# EAGLE board TLog (EAGLE 8.5.1)
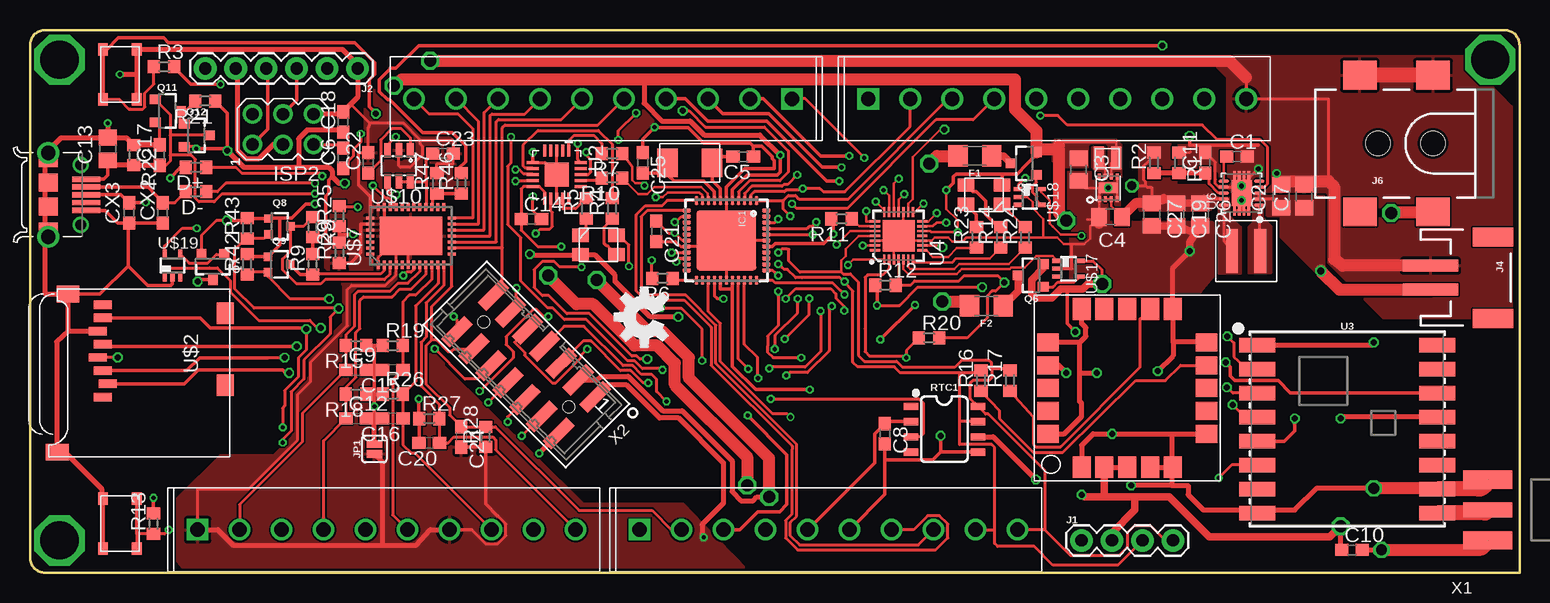
[diagram p7: board, top side]
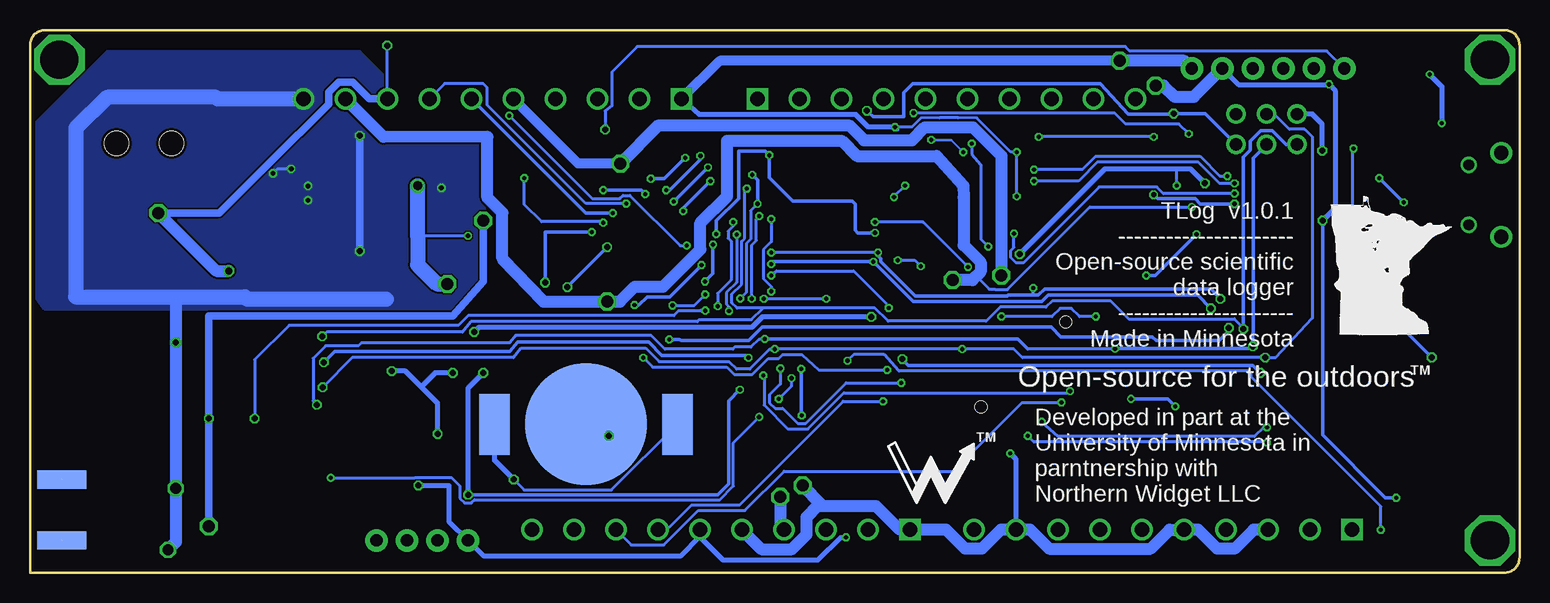
[diagram p8: board, bottom side, seen from below]

Size 124.13 x 45.27 mm. Coordinates in mm from the lower left corner, seen from the top.
Outline: 0,44 0,1.27 arc90 1.27,0 124.13,0 124.13,44 arc90 122.86,45.27 1.27,45.27 arc90 0,44
Copper layers (1*16): Top 0.035559375mm / dielectric 1.6mm / Bottom 0.035559375mm
Design rules "BayAreaCircuit *": minimum track width 5mil, minimum drill 10mil, track to track 5mil, track to pad 6mil, pad to pad 6mil, via to via 6mil, smd to smd 5mil, copper to edge 10mil, drill to drill 6mil, minimum pad ring 6mil, minimum via ring 6mil, stop-mask expansion 2.5mil, vias tented up to drill 0mil, thermal gap 10mil
tKeepout: area 0.1,40.5 to 4.8,45.1; area 0.1,0.4 to 4.8,5; area 119.4,40.5 to 124,45.1

## Footprints (pad centres in the part's own frame; a part is rotated, then mirrored left to right if it is on the bottom)
AWICKERT_LINX_BAT-HLD-012-SMT = smd 10.16 x 10.16: GND 0,0 | smd 2.54 x 5.08: POWER0 -7.62,0; POWER1 7.62,0
C0603 = smd 1.1 x 1: 1 -0.85,0; 2 0.85,0
C0805 = smd 1.3 x 1.5: 1 -0.95,0; 2 0.95,0
R0603 = smd 1 x 1.1: 1 -0.85,0; 2 0.85,0
1206 = smd 1.6 x 1.8: 1 -1.4,0; 2 1.4,0
MLF44-TH = smd 0.7 x 0.3: 1 -3.325,2.5; 2 -3.325,2; 3 -3.325,1.5; 4 -3.325,1; 5 -3.325,0.5; 6 -3.325,0; 7 -3.325,-0.5; 8 -3.325,-1; 9 -3.325,-1.5; 10 -3.325,-2; 11 -3.325,-2.5; 23 3.325,-2.5; 24 3.325,-2; 25 3.325,-1.5; 26 3.325,-1; 27 3.325,-0.5; 28 3.325,0; 29 3.325,0.5; 30 3.325,1; 31 3.325,1.5; 32 3.325,2; 33 3.325,2.5 | smd 0.3 x 0.7: 12 -2.5,-3.325; 13 -2,-3.325; 14 -1.5,-3.325; 15 -1,-3.325; 16 -0.5,-3.325; 17 0,-3.325; 18 0.5,-3.325; 19 1,-3.325; 20 1.5,-3.325; 21 2,-3.325; 22 2.5,-3.325; 34 2.5,3.325; 35 2,3.325; 36 1.5,3.325; 37 1,3.325; 38 0.5,3.325; 39 0,3.325; 40 -0.5,3.325; 41 -1,3.325; 42 -1.5,3.325; 43 -2,3.325; 44 -2.5,3.325 | smd 5 x 5: TH 0,0
AVRISP = drill 1.02 pad 1.626: 1 -1.27,2.54; 2 1.27,2.54; 3 -1.27,0; 4 1.27,0; 5 -1.27,-2.54; 6 1.27,-2.54
1X04 = drill 1.016 pad 1.88: 1 0,0; 2 2.54,0; 3 5.08,0; 4 7.62,0
1X06 = drill 1.016 pad 1.88: 1 0,0; 2 2.54,0; 3 5.08,0; 4 7.62,0; 5 10.16,0; 6 12.7,0
JST-2-SMD = smd 1 x 4.6: 1 -1,-3.7; 2 1,-3.7 | smd 1.6 x 3.4: NC1 -3.4,1.5; NC2 3.4,1.5
1X10_3.5MM_SCREW = drill 1.2 square: P$1 0,0 | drill 1.2: P$2 3.5,0; P$3 7,0; P$4 10.5,0; P$5 14,0; P$6 17.5,0; P$7 21,0; P$8 24.5,0; P$9 28,0; P$10 31.5,0
POWER_JACK_SMD = smd 2.8 x 2.4: GND 0,-5.7; P$4 6.1,-5.7; VIN0 0,5.7; VIN1 6.1,5.7 | hole 2.032: 0,0; 4.572,0
SMT-JUMPER_2_NC_PASTE_SILK = smd 0.635 x 1.27: 1 -0.406,0; 2 0.406,0
0806 = smd 0.85 x 1.9: P$1 -0.725,0; P$2 0.725,0
10118194-0001LF_10118194-0001LF_LONGER_PADS = smd 0.45 x 2.35: 1 -1.3,3.175; 2 -0.65,3.175; 3 0,3.175; 4 0.65,3.175; 5 1.3,3.175 | drill 0.9: P$6 -2.5,2.7; P$7 2.5,2.7 | drill 1.2: P$8 -3.5,0; P$9 3.5,0 | smd 1.5 x 1.55: P$10 -1,0; P$11 1,0; P$12 -3.05,0; P$13 3.05,0
SOT23-3 = smd 0.8 x 0.9: 1 -0.95,-1; 2 0.95,-1; 3 0,1.1
SOT323 = smd 0.7 x 0.7: 1 -0.65,-0.925; 2 0.65,-0.925; 3 0,0.925
SO08 = smd 0.6 x 1.2: 1 -1.905,-2.8; 2 -0.635,-2.8; 3 0.635,-2.8; 4 1.905,-2.8; 5 1.905,2.8; 6 0.635,2.8; 7 -0.635,2.8; 8 -1.905,2.8
QFN20 = smd 1 x 0.25: 1 -2.032,0.968; 2 -2.032,0.468; 3 -2.032,-0.032; 4 -2.032,-0.532; 5 -2.032,-1.032; 11 1.968,-1.032; 12 1.968,-0.532; 13 1.968,-0.032; 14 1.968,0.468; 15 1.968,0.968 | smd 0.25 x 1: 6 -1.032,-2.032; 7 -0.532,-2.032; 8 -0.032,-2.032; 9 0.468,-2.032; 10 0.968,-2.032; 16 0.968,1.968; 17 0.468,1.968; 18 -0.032,1.968; 19 -0.532,1.968; 20 -1.032,1.968 | smd 2 x 2: 21 -0.032,-0.032
RFM69HCW-XXXS2 = smd 3 x 1.2: 1 -7.5,7; 2 -7.5,5; 3 -7.5,3; 4 -7.5,1; 5 -7.5,-1; 6 -7.5,-3; 7 -7.5,-5; 8 -7.5,-7; 9 7.5,-7; 10 7.5,-5; 11 7.5,-3; 12 7.5,-1; 13 7.5,1; 14 7.5,3; 15 7.5,5; 16 7.5,7
QFN-28 = smd 0.85 x 0.2: 1 -1.975,1.2; 2 -1.975,0.8; 3 -1.975,0.4; 4 -1.975,0; 5 -1.975,-0.4; 6 -1.975,-0.8; 7 -1.975,-1.2; 15 1.975,-1.2; 16 1.975,-0.8; 17 1.975,-0.4; 18 1.975,0; 19 1.975,0.4; 20 1.975,0.8; 21 1.975,1.2 | smd 0.2 x 0.85: 8 -1.2,-1.975; 9 -0.8,-1.975; 10 -0.4,-1.975; 11 0,-1.975; 12 0.4,-1.975; 13 0.8,-1.975; 14 1.2,-1.975; 22 1.2,1.975; 23 0.8,1.975; 24 0.4,1.975; 25 0,1.975; 26 -0.4,1.975; 27 -0.8,1.975; 28 -1.2,1.975 | smd 2.65 x 2.65: 29 0,0
PWSON-N10 = smd 0.28 x 0.85: 1 -1,-1.475; 2 -0.5,-1.475; 3 0,-1.475; 4 0.5,-1.475; 5 1,-1.475; 6 1,1.475; 7 0.5,1.475; 8 0,1.475; 9 -0.5,1.475; 10 -1,1.475 | smd 2.15 x 1.66: THERMAL@1 0,0 | drill 0.4 pad 0.6: THERMAL@5 -0.6,0; THERMAL@6 0.6,0 | smd 0.8 x 0.23: THERMAL@7 1.46,0.6; THERMAL@8 1.46,0.2; THERMAL@9 1.46,-0.2; THERMAL@10 1.46,-0.6; THERMAL@11 -1.46,-0.6; THERMAL@12 -1.46,-0.2; THERMAL@13 -1.46,0.2; THERMAL@14 -1.46,0.6
CRYSTAL_5X3.2_2-SMD = smd 1.7 x 2.4: OSC1 -1.85,0; OSC2 1.85,0
MICROSD = smd 0.7 x 1.5: 1 9,-10.64; 2 7.9,-10.24; 3 6.8,-10.64; 4 5.7,-11.04; 5 4.6,-10.64; 6 3.5,-11.04; 7 2.4,-10.64; 8 1.3,-10.64 | smd 1.8 x 1.4: CD1 2,-0.44; CD2 8,-0.44 | smd 1.4 x 1.9: MT1 0.4,-13.54; MT2 13.6,-14.44
WSON-8-PAD = smd 0.25 x 0.5: 1 -0.75,-0.95; 2 -0.25,-0.95; 3 0.25,-0.95; 4 0.75,-0.95; 5 0.75,0.95; 6 0.25,0.95; 7 -0.25,0.95; 8 -0.75,0.95 | smd 1.6 x 0.9: PAD 0,0
SWITCH_4.2X3.2 = smd 1.05 x 0.812: 1 -2.075,1.4; 2 2.075,1.4; 3 -2.075,-1.4; 4 2.075,-1.4
SAM-M8Q = smd 1.5 x 1.8: 1 -3.8,-6.6; 2 -1.9,-6.6; 3 0,-6.6; 4 1.9,-6.6; 5 3.8,-6.6; 11 3.8,6.6; 12 1.9,6.6; 13 0,6.6; 14 -1.9,6.6; 15 -3.8,6.6 | smd 1.8 x 1.5: 6 6.6,-3.8; 7 6.6,-1.9; 8 6.6,0; 9 6.6,1.9; 10 6.6,3.8; 16 -6.6,3.8; 17 -6.6,1.9; 18 -6.6,0; 19 -6.6,-1.9; 20 -6.6,-3.8
QFN38-5X7 = smd 0.7 x 0.25: 1 -2.4,2.75; 2 -2.4,2.25; 3 -2.4,1.75; 4 -2.4,1.25; 5 -2.4,0.75; 6 -2.4,0.25; 7 -2.4,-0.25; 8 -2.4,-0.75; 9 -2.4,-1.25; 10 -2.4,-1.75; 11 -2.4,-2.25; 12 -2.4,-2.75; 20 2.4,-2.75; 21 2.4,-2.25; 22 2.4,-1.75; 23 2.4,-1.25; 24 2.4,-0.75; 25 2.4,-0.25; 26 2.4,0.25; 27 2.4,0.75; 28 2.4,1.25; 29 2.4,1.75; 30 2.4,2.25; 31 2.4,2.75 | smd 0.25 x 0.7: 13 -1.5,-3.4; 14 -1,-3.4; 15 -0.5,-3.4; 16 0,-3.4; 17 0.5,-3.4; 18 1,-3.4; 19 1.5,-3.4; 32 1.5,3.4; 33 1,3.4; 34 0.5,3.4; 35 0,3.4; 36 -0.5,3.4; 37 -1,3.4; 38 -1.5,3.4 | smd 3.2 x 5.2: EXP 0,0
WE-MAIA(4.1X4.1) = smd 0.98 x 3.7: P$1 -1.185,0; P$2 1.185,0
SOT23-6L = smd 0.55 x 1.2: 1 -0.95,-1.3; 2 0,-1.3; 3 0.95,-1.3; 4 0.95,1.3; 5 0,1.3; 6 -0.95,1.3
CLVBA-FKA = smd 1.4 x 1.1: 1 -1.5,0.8; 2 -1.5,-0.8; 3 1.5,-0.8; 4 1.5,0.8
DCK_R-PDSO-G5 = smd 0.35 x 0.8: 1 -0.65,-0.95; 2 0,-0.95; 3 0.65,-0.95; 4 0.65,0.95; 5 -0.65,0.95
ADAFRUIT_SMA_EDGELAUNCH = smd 4.064 x 1.524: GND@1 2.032,-2.54; GND@2 2.032,2.54 | smd 4.064 x 1.524 bottom: GND@3 2.032,2.54; GND@4 2.032,-2.54 | smd 4.064 x 1.27: P 2.032,0
87832-14 = smd 1 x 2.75: 1 -6,-2.15; 2 -6,2.15; 3 -4,-2.15; 4 -4,2.15; 5 -2,-2.15; 6 -2,2.15; 7 0,-2.15; 8 0,2.15; 9 2,-2.15; 10 2,2.15; 11 4,-2.15; 12 4,2.15; 13 6,-2.15; 14 6,2.15 | hole 1: -5,0; 5,0

## Placement (x,y rotation side)
BT1  BATTERY_COIN12MM  [AWICKERT_LINX_BAT-HLD-012-SMT]  77.79,12.38 0 bottom
C1  0.1uF  [C0603]  100.58,34.7 0 top
C2  10uF  [C0805]  104.27,31.4 90 top
C3  22uF  [C0805]  87.38,33.62 270 top
C4  2.2uF  [C0805]  90.04,29.69 180 top
C5  12pF  [C0603]  59.44,34.7 180 top
C6  0.1uF  [C0603]  26.1,34.58 90 top
C7  10uF  [C0805]  106.17,31.4 90 top
C8  0.1uF  [C0603]  71.25,11.59 270 top
C9  0.1uF  [C0603]  27.18,16.92 0 top
C10  0.1uF  [C0603]  110.17,1.9 0 top
C11  10pF  [C0603]  97.92,34.19 90 top
C12  0.1uF  [C0603]  27.18,12.86 0 top
C13  10uF  [C0805]  6.48,35.34 90 top
C14  0.1uF  [C0603]  41.78,29.5 0 top
C15  0.1uF  [C0603]  30.23,16.92 180 top
C16  0.1uF  [C0603]  30.23,12.86 180 top
C17  0.1uF  [C0603]  10.79,34.83 90 top
C18  0.1uF  [C0603]  26.1,37.59 90 top
C19  22uF  [C0805]  95.5,29.88 270 top
C20  0.1uF  [C0603]  33.27,10.83 180 top
C21  1uF  [C0603]  52.2,28.48 270 top
C22  0.1uF  [C0603]  28.19,34.19 90 top
C23  0.1uF  [C0603]  34.42,34.96 0 top
C24  0.1uF  [C0603]  35.94,11.33 270 top
C25  12pF  [C0603]  51.05,34.19 270 top
C26  22uF  [C0805]  97.54,29.88 270 top
C27  22uF  [C0805]  93.47,29.88 270 top
CX2  12pF  [C0603]  11.05,30 90 top
CX3  12pF  [C0603]  8.25,30 90 top
D+  27ohm  [R0603]  13.84,33.81 180 top
D-  27ohm  [R0603]  13.84,31.78 180 top
F1  PPTC_HALF-AMP  [1206]  78.74,34.77 180 top
F2  PPTC_HALF-AMP  [1206]  79.69,22.26 180 top
IC1  ATMEGA644M  [MLF44-TH]  58.04,27.72 270 top
ISP2  AVRISP-6  [AVRISP]  21.08,36.99 90 top
J1  [1X04]  87.63,2.7 0 top
J2  [1X06]  27.3,42.07 180 top
J4  [JST-2-SMD]  120.41,24.61 270 top
J5  [1X10_3.5MM_SCREW]  63.5,39.53 180 top
J6  5.5x2.1mm Barrel  [POWER_JACK_SMD]  116.92,35.8 180 top
J8  [1X10_3.5MM_SCREW]  13.97,3.59 0 top
J9  [1X10_3.5MM_SCREW]  50.8,3.59 0 top
J10  [1X10_3.5MM_SCREW]  69.85,39.53 0 top
JP1  JUMPER-SMT_2_NC_PASTE_SILK  [SMT-JUMPER_2_NC_PASTE_SILK]  28.7,10.32 90 top
L2  2.2uF  [0806]  89.79,34.58 0 top
LOGO1  OSHW-LOGOM  [OSHW-LOGO-M]  51.18,21.33 90 top
MICRO_USB  MICRO_USB_LONGPADS  [10118194-0001LF_10118194-0001LF_LONGER_PADS]  1.52,31.53 270 top
Q5  MOSFET_PCH-IRLML2244  [SOT23-3]  82.87,34.13 90 top
Q6  MOSFET_PCH-IRLML2244  [SOT23-3]  83.44,24.8 90 top
Q7  MOSFET_PCH-IRLML2244  [SOT23-3]  15.24,25.56 180 top
Q8  310mA/60V/1.6Ω  [SOT323]  20.8,28.89 270 top
Q9  310mA/60V/1.6Ω  [SOT323]  20.76,25.72 270 top
Q11  MOSFET-NCH-BSS138  [SOT23-3]  11.43,38.51 270 top
Q12  MOSFET_PCH-IRLML2244  [SOT23-3]  13.84,36.48 270 top
R1  111k  [R0603]  95.76,34.19 270 top
R2  1M  [R0603]  93.66,34.19 90 top
R3  10k  [R0603]  11.18,42.2 0 top
R4  330  [R0603]  48.51,30.38 90 top
R5  330  [R0603]  46.35,30.38 90 top
R6  330  [R0603]  52.7,24.54 180 top
R7  330  [R0603]  48.51,34.96 180 top
R8  10k  [R0603]  23.56,28.83 270 top
R9  10k  [R0603]  23.56,25.72 90 top
R10  330  [R0603]  48.51,32.92 180 top
R11  10k  [R0603]  67.63,29.53 180 top
R12  10k  [R0603]  71.28,23.97 0 top
R13  10k  [R0603]  10.29,4.1 90 top
R14  330  [R0603]  80.9,27.97 90 top
R15  10k  [R0603]  27.18,18.95 180 top
R16  FB  [R0603]  79.25,16.03 90 top
R17  FB  [R0603]  81.66,16.03 90 top
R18  10k  [R0603]  27.18,14.89 180 top
R19  10k  [R0603]  30.23,18.95 0 top
R20  180k  [R0603]  74.93,19.59 0 top
R21  10k  [R0603]  14.6,39.34 180 top
R22  10k  [R0603]  8.64,34.83 270 top
R23  330  [R0603]  78.87,27.97 90 top
R24  330  [R0603]  82.93,27.97 90 top
R25  10k  [R0603]  25.78,29.75 90 top
R26  10k  [R0603]  30.23,14.89 0 top
R27  10k  [R0603]  33.27,12.86 0 top
R28  10k  [R0603]  37.97,11.33 90 top
R29  10k  [R0603]  25.78,26.7 90 top
R42  10k  [R0603]  18.1,25.72 90 top
R43  10k  [R0603]  18.1,28.73 90 top
R46  10k  [R0603]  35.94,32.48 90 top
R47  10k  [R0603]  33.91,32.48 90 top
RTC1  DS3231M  [SO08]  76.2,11.97 270 top
U2  FT231X-Q  [QFN20]  43.94,33.18 270 top
U3  915MHz  [RFM69HCW-XXXS2]  109.78,11.99 0 top
U4  SX1509  [QFN-28]  72.39,28.1 90 top
U6  [PWSON-N10]  100.97,31.65 90 top
U$1  CRYSTAL_5X3.2_2LEAD8MHZ  [CRYSTAL_5X3.2_2-SMD]  54.99,34.19 0 top
U$2  MICROSD  [MICROSD]  16.7,23.65 270 top
U$3  NWLOGO_MED  [NWLOGO_MED]  49.07,8.76 0 bottom
U$4  TPS62172-Q1  [WSON-8-PAD]  89.85,32.1 0 top
U$5  BUTTON4.2X3.2  [SWITCH_4.2X3.2]  7.49,4.1 90 top
U$6  SAM-M8Q  [SAM-M8Q]  91.44,15.4 0 top
U$7  LTC2495  [QFN38-5X7]  31.75,28.1 90 top
U$8  1uH  [WE-MAIA(4.1X4.1)]  101.35,26.83 180 top
U$9  BUTTON4.2X3.2  [SWITCH_4.2X3.2]  7.49,41.56 270 top
U$10  MAX6070AAUT18  [SOT23-6L]  30.73,33.94 180 top
U$13  [MN_SILK]  7.38,19.81 0 top
U$15  CLVBA-FKA  [CLVBA-FKA]  79.5,31.53 180 top
U$16  CLVBA-FKA  [CLVBA-FKA]  47.37,27.34 0 top
U$17  MIC842H  [DCK_R-PDSO-G5]  86.55,25.37 270 top
U$18  MIC842H  [DCK_R-PDSO-G5]  83.31,31.34 270 top
U$19  MIC842H  [DCK_R-PDSO-G5]  11.87,25.62 0 top
X1  [ADAFRUIT_SMA_EDGELAUNCH]  123.51,5.24 180 top
X2  87832-14  [87832-14]  41.35,17.38 135 top

## Tracks (layer width: path | path; a pad name or v marks a point on that pad's centre or on a via)
3.3V_EXT_CTRL  (via drill 0.35)
  Top 0.203: U4.13 75.24,28.9 75.56,29.21 75.87,29.21 v76.36,29.19
  Top 0.254: v82.93,32.92 82.36,32.36 U$18.1
  Bottom 0.254: v76.36,29.19 76.36,29.27 81.5,29.27 82.93,30.7 v82.93,32.92
3V3  (via drill 0.35, 0.4, 0.5, 0.5 pad 0.2, 1)
  Top 0.2: v77.31,28.42 77.31,29.4 76.36,30.35 v76.36,31.91 | U$4.6 90.1,34.16 L2.P$2 90.51,35.9 86.11,35.9 85.74,35.64
  Top 0.203: U4.18 72.39,31.11 v72.87,31.59 | U4.4 72.39,23.97 | 77.17,28.43 v77.31,28.42 | 77.31,28.5 v77.31,28.42 | U4.12 75.01,28.5 75.09,28.42 v77.31,28.42
  Top 0.254: v16.42,29.37 15.53,29.37 14.29,28.13 Q7.2 | 72.39,23.97 73.34,23.97 73.71,24.34 77.42,24.34 77.85,24.78 80.65,24.78 v81.2,24.21 80.48,23.49 80.16,23.49 79.75,23.08 79.75,21.24 78.1,19.59 R20.2 | C21.1 53.17,28.35 v53.72,28.35 54.36,27.72 IC1.17 | v30.49,31.53 30.16,31.53 29.78,31.91 U$10.4
  Top 0.305: 19.77,26.57 Q9.1 | R43.2 18.1,29.84 | v16.42,29.37 18.1,29.37 R43.2 | Q7.2 14.13,26.56 | 72.39,23.97 R12.2 | R11.2 66.94,29.37 v66.94,28.26 | v64.97,15.27 60.48,15.27 58.54,17.21 58.54,23.65 | 58.54,23.65 IC1.29 | IC1.27 57.54,23.65 58.54,23.65 | IC1.5 | 58.56,31.04 IC1.5 | v62.52,34.82 62.52,33.42 62.28,33.18 59.78,33.18 58.54,31.94 IC1.5 | v10.29,6.25 R13.2 | v76.36,31.91 76.95,32.5 76.95,33.02 77.19,33.27 81,33.27 | 81,33.27 82.26,33.27 83.06,34.07 83.87,34.88 Q5.2 | U$15.2 81,33.27 | IC1.38 61.84,27.22 62.09,27.47 66.15,27.47 v66.94,28.26 | 66.93,29.2 v66.94,28.26 | 20.8,29.59 21.83,29.59 23,30.77 v23.75,30.77 | R3.2 12.03,42.11 13.4,40.74 v15.87,40.74 | 20.8,29.59 20.8,27.32 Q9.1 | Q9.1 18.3,26.37 R42.2 | 20.8,29.59 19.92,29.59 Q8.1 18.14,29.54 R43.2
  Top 0.406: C10.1 109.22,2.01 v109.22,3.89 | U3.13 109.22,12.99 v109.22,12.86 | 89.31,6.35 89.54,6.58 | U$6.2 U$6.3 | U$6.17 85.73,17.3 v86.36,16.67 | v62.52,34.82 60.83,36.51 56.19,36.51 55.02,37.68 52.64,37.68 51.18,39.15 51.18,41.14
  Top 0.61: v109.22,3.89 108.33,3.02 98.27,3.02 94.93,6.35 92.08,6.35 | 92.08,6.35 89.31,6.35 87.92,6.35 v87.63,6.51 | J1.2 90.17,3.33 92.08,5.24 92.08,6.35 | 89.54,6.58 U$6.2
  Top 1.016: v30.32,40.64 30.95,41.14 51.18,41.14 82.07,41.14 82.07,38.65 83.87,36.86 Q5.2 84.1,35.32 85.74,35.32 | v86.36,29.37 85.74,30.02 85.74,35.32 | 85.74,35.32 85.74,35.64
  Bottom 0.305: J2.2 | v16.42,29.37 16.42,11.49 11.18,6.25 v10.29,6.25 | v72.87,31.59 73.18,31.91 v76.36,31.91 | v81.2,24.21 81.2,28.42 v77.31,28.42 | v87.63,6.51 66.8,6.51 65.91,7.4 65.91,14.33 v64.97,15.27 | v53.72,28.35 55.16,28.35 55.37,28.57 55.37,30.77 55.63,31.02 60.58,31.02 62.52,32.96 v62.52,34.82 62.86,35.16 65.09,35.16 65.09,31.22 66.94,29.37 v66.94,28.26 | v23.75,30.77 26.61,30.77 27.05,31.2 30.16,31.2 v30.49,31.53
  Bottom 0.406: J2.2 23.43,40.73 15.88,40.73 v15.87,40.74 15.37,40.23 15.37,30.42 v16.42,29.37 | v86.36,16.67 87.63,15.4 v87.63,6.51
  Bottom 0.61: v109.22,3.89 v109.22,12.86 109.22,21.43 88.9,21.43 86.36,24.29 v86.36,29.37
  Bottom 1.016: v30.32,40.64 29.69,40.64 28.73,39.69 27.15,39.69 J2.2
  pour Top (isolate 0.152, rank 2, no thermals): 89.92,33.05 89.92,35.59 89.66,35.85 88.39,35.85 88.14,35.59 88.14,33.81 85.73,33.81 85.22,34.32 85.22,35.97 85.34,36.1 90.55,36.1 90.93,35.72 90.93,33.05
5V  (via drill 0.35, 0.5, 0.75, 1)
  Top 0.2: C4.1 90.1,30.58 U$4.3 U$4.2
  Top 0.203: v87.63,28.1 87.51,28.22 85.88,28.22 85.21,28.89 84.97,29.14 84.97,31.03 84.26,31.74 U$18.5
  Top 0.254: U6.9 97.83,31.15 97.83,31.4 | R2.2 93.66,34.79 93,34.12 92.83,33.96 92.83,32.73 92.96,32.6 92.96,32.29 | C27.1 93.47,32.16 93.09,32.16 92.96,32.29 | v91.82,32.29 92.96,32.29 | 30.26,30.5 U$7.29 | 30.26,30.5 U$7.28 | 30.26,30.5 30.26,30.86 29.85,31.27 29.59,31.27 v28.58,32.29 | U$17.5 88.57,26.02 89.34,25.24 v89.34,24.1 | 45.83,26.54 U$16.2 | 12.84,35.37 Q12.2 13.7,35.53 v13.84,35.39 | U$19.5 11.22,27.26 12.7,28.73 v13.91,28.73
  Top 0.305: 97.83,31.4 C26.1 | R9.2 R8.2 24.26,27.98 24.64,28.35 24.64,31.4 24.89,31.65 24.89,32.73 25.18,33.03 | 45.87,26.49 U$16.2 | v87.12,20.08 86.43,20.77 86.43,23.67 | R21.1 16.45,38.35 v16.45,35.19 16.26,35.39 v13.84,35.39
  Top 0.406: v16.45,35.19 17.83,33.81 22.35,33.81 | C18.1 25.96,36.95 23.14,36.95 22.39,36.2 22.39,33.92 22.35,33.81 | v54.02,21.35 51.7,21.35 48.77,24.29 48.77,24.83 47.1,26.49 45.87,26.49 41.74,26.49 v41.66,26.57 | v26.23,32.48 25.73,32.48 25.18,33.03 25.18,33.52 24.89,33.81 22.35,33.81
  Top 0.61: 94.68,31.11 C27.1 | 94.68,31.11 C19.1 C26.1 | 94.49,31.3 94.68,31.11 | v89.34,24.1 88.16,24.1 87.74,23.67 86.43,23.67 85.88,23.67 85.14,22.93 83.8,22.93 83.47,23.26 83.47,24.43 84.44,25.4 Q6.2
  Top 0.813: C27.1 92.13,30.83 C4.1
  Bottom 0.254: v87.63,28.1 91.82,28.1 91.82,28.09 | v28.58,32.29 28.58,33.69 | v13.91,28.73 13.91,35.32 v13.84,35.39
  Bottom 0.305: 86.9,20.3 v87.12,20.08
  Bottom 0.406: v16.45,35.19 16.45,37.43 17.27,38.26 ISP2.2 | v41.66,26.57 34.54,33.69 28.58,33.69 27.43,33.69 v26.23,32.48 | v54.02,21.35 63.09,21.35 63.97,20.47 86.73,20.47 v87.12,20.08
  Bottom 1.27: v91.82,32.29 91.82,28.09 91.82,25.69 90.23,24.1 v89.34,24.1
  pour Top (isolate 0.152, rank 3, no thermals): 99.95,31.27 98.93,31.27 97.92,32.29 95.5,32.29 95.5,35.72 92.46,35.72 92.46,30.26 98.3,30.26 98.93,31.02 99.95,31.02
5V_EXT_CTRL
  Top 0.2: 81.34,25.32 81.66,25.32 81.78,25.45 82.89,25.45 83.84,26.4 85.22,26.4 U$17.1
  Top 0.203: U4.5 72.79,25.32 73.18,24.92 77.23,24.92 77.47,25.16 77.63,25.32 | 77.63,25.32 | 77.63,25.32 | 77.63,25.32 | 77.63,25.32 81.34,25.32 | 85.37,26.02 U$17.1
5V_PSYNC  (via drill 0.35)
  Top 0.2: U4.27 69.42,27.3 v69.4,27.28
  Top 0.254: v84.2,38.13 85.65,38.13 86.44,37.34 97.7,37.34 98.92,36.11 102.51,36.11 103.14,35.48 103.14,32.44 102.86,32.15 U6.4
  Bottom 0.254: v84.2,38.13 77.28,31.2 74.97,31.2 74.7,31.46 74.14,31.46 69.96,27.28 v69.4,27.28
ADC0
  Top 0.254: U$7.8 32.5,25.17 31.5,24.16 30.68,24.16 30,23.48 27.35,23.48 27.03,23.17 27.03,20.55 26.33,19.84 R15.2 C9.1 22.71,13.3 22.71,10.93 17.47,5.7 J8.P$2
ADC1
  Top 0.254: U$7.9 33.01,24.91 31.75,23.65 30.82,23.65 30.19,23.02 27.8,23.02 27.49,22.7 27.49,20.36 27.16,20.03 27.16,16.31 26.33,15.48 R18.2 C12.1 24.47,11 J8.P$4
ADC2
  Top 0.254: U$7.10 33.5,24.51 32.13,23.15 31.62,23.15 31.08,22.6 R19.2 C15.1 30.23,16.07 30.23,4.83 J8.P$6
ADC3
  Top 0.254: U$7.11 34,24.13 32.13,22.26 32.13,15.95 R26.2 C16.1 31.08,10.67 31.76,9.99 32.07,9.99 J8.P$8
ADC4
  Top 0.203: U$7.12 34.5,25.59 34.53,25.56
  Top 0.254: U$7.12 34.5,23.99 33.02,22.51 33.02,19.65 32.59,19.22 32.59,15.58 34.12,14.04 R27.2 C20.1 34.84,10.83 35.32,11.31 38.59,11.31 38.8,11.1 38.8,10.26 J8.P$10
ADC5
  Top 0.254: J9.P$2 53.45,3.59 51.84,5.2 45.76,5.2 38.77,12.18 R28.2 C24.1 34.96,13.16 34.96,13.77 32.99,15.75 32.99,18.92 33.46,19.4 | X2.12 35.35,18.69 35.1,18.44 34.83,18.44 33.88,19.4 33.46,19.4 | U$7.13 35.15,23.88 33.46,22.19 33.46,19.4
ADC6
  Top 0.254: 39.37,27.1 U$7.14 | J5.P$5 47.32,37.34 39.6,37.34 39.37,37.12 39.37,27.1 | X2.13 39.37,23.88 39.37,27.1
ADC7
  Top 0.254: U$7.15 38.86,27.6 38.86,37.62 39.04,37.8 44.27,37.8 J5.P$6
ADC8
  Top 0.254: U$7.16 38.35,28.1 38.35,38.13 38.48,38.26 41.23,38.26 J5.P$7
ADC9
  Top 0.254: U$7.17 37.85,28.6 37.85,38.37 J5.P$8
ADC10
  Top 0.254: U$7.18 37.39,29.1 37.39,37.64 J5.P$9
ADC11
  Top 0.254: U$7.19 35.17,29.62 36.93,29.62 36.93,37.01 35.69,38.26 33.27,38.26 J5.P$10
ALIVE_LED  (via drill 0.35)
  Top 0.254: R6.2 51.82,24.58 v51.82,26.07 | v49.91,25.56 49.91,27.34 49.11,28.14 U$16.4
  Bottom 0.254: v51.82,26.07 50.42,26.07 v49.91,25.56
BATT  (via drill 0.5, 0.6, 1)
  Top 0.254: C2.1 arc90 103.69,31.15 U6.2 U6.3
  Top 0.305: v94.36,43.97 32.38,43.97 30.48,42.07 30,42.07 30,42.02 29.12,41.14 29.12,40.14 29.82,39.44 30,39.44 32.74,36.7 35.2,36.7 36.3,35.6 36.3,34.31 35.69,33.7 R46.2
  Top 0.61: 104.78,30.13 104.2,30.7
  Top 1.016: v107.57,25.18 109.14,23.61 J4.2 | v113.43,30 113.52,30.1 J6.VIN0
  Bottom 0.254: J10.P$8 94.35,43.96 v94.36,43.97
  Bottom 0.61: v113.43,30 108.34,30 104.22,34.12 104.21,34.12 99.25,39.09 99.25,40.08 98.4,40.92 97.23,40.92 95.84,39.53 J10.P$8
  Bottom 1.016: v113.43,30 108.6,25.18 v107.57,25.18
  pour Top (no thermals): 108.33,23.91 104.27,27.97 104.27,29.75 103.12,29.75 103.12,30.89 101.98,30.89 101.98,31.4 107.82,31.4 107.82,25.43 108.46,24.8 108.46,23.91
COM  (via drill 0.35)
  Top 0.254: v31.12,24.8 31.39,25.07 31.74,25.07 32,25.33 U$7.7
  Top 0.305: 25.78,28.15 R29.2 | 25.78,28.15 R25.1 | v26.92,28.23 25.86,28.23 25.78,28.15
  Bottom 0.305: v31.12,24.8 30.35,24.8 v26.92,28.23
D1_UNIV  (via drill 0.35)
  Top 0.254: IC1.40 65.23,28.22 v65.24,28.2 | v65.88,21.82 65.88,18.45 64.59,17.16 61.7,17.16 v61.59,17.05 | X2.5 44.28,17.52 46.08,19.32 46.75,19.32 49.2,16.87 50.05,16.87 51.09,15.84 v51.52,15.84
  Bottom 0.254: v65.24,28.2 65.24,24.23 66.1,23.37 66.1,22.4 65.88,22.18 v65.88,21.82 | v61.59,17.05 61.59,15.74 62.5,14.83 62.5,14.18 62.05,13.73 61.41,13.73 60.14,12.46 59.49,12.46 56.11,15.84 v51.52,15.84
D2_UNIV  (via drill 0.35)
  Top 0.254: IC1.41 64.75,28.72 64.95,28.91 65.2,28.91 v65.53,29.24 | v66.82,22.24 66.59,22 66.59,18.51 64.78,16.7 63.28,16.7 v63.03,16.45 | X2.14 35.59,21.09 v35.31,21.37 | v43.18,21.37 42.81,21.37 42.21,21.97 41.94,21.97 39.67,19.7 39.67,19.02 40.25,18.44 40.25,17.93 v37.46,15.14
  Bottom 0.254: v65.53,29.24 65.53,28.91 65.95,28.5 65.95,27.91 65.7,27.66 65.7,24.42 66.82,23.29 v66.82,22.24 | v63.03,16.45 62.96,16.38 62.96,14 60.97,12 59.3,12 56.3,15 37.61,15 v37.46,15.14 | v35.31,21.37 36.66,21.37 37.34,22.05 38.28,22.05 38.96,21.37 v43.18,21.37
DTR  (via drill 0.35)
  Top 0.254: v49.02,36.1 49.02,36.86 v50.51,38.35 | v27.56,36.61 27.56,35.91 26.94,35.29 26.94,34.76 26.1,33.92 C6.1 | U2.18 46.51,33.21 46.74,33.43 46.74,34.45 46.35,34.83 v46.35,35.08
  Bottom 0.2: v46.35,35.08 47.37,36.1 v49.02,36.1
  Bottom 0.254: v27.56,36.61 28.39,37.44 32.83,37.44 33.74,38.35 v50.51,38.35
EXT_3.3V  (via drill 0.35, 1)
  Top 0.305: 71.41,12.6 arc90 C8.1 70.38,11.57 70.38,9.17 J9.P$5 | 71.41,12.6 RTC1.2 | 71.41,12.38 71.41,12.6
  Top 0.406: v42.43,9.95 42.43,9.98 X2.2
  Top 1.016: v74.93,34.13 75.56,34.77 F1.2 | v43.18,24.8 43.65,24.29 45.54,22.41 46.93,22.41 50.39,18.95 52.25,18.95 53.75,17.46 53.75,15.68 59.75,9.67 v59.75,7.27
  Bottom 0.406: J8.P$9 41.97,9.49 v42.43,9.95
  Bottom 0.813: 74.95,34.13 78.45,34.13 J10.P$5
  Bottom 1.016: v74.93,34.13 74.95,34.13 71.83,37.27 55.82,37.27 54.63,36.08 50.62,36.08 49.56,37.15 45.55,37.15 43.18,34.77 v43.18,24.8 | J9.P$5 63.19,1.98 60.63,1.98 59.41,3.2 59.41,4.64 58.47,5.58 58.25,5.58 58.15,5.67 | 58.15,5.67 v59.75,7.27 | 58.15,5.67 58.06,5.58 53.63,5.58 51.64,3.59 J9.P$1 47.79,3.59 46.2,2 44.8,2 43.22,3.59 J8.P$9 40.79,3.59 39.2,2 30.74,2 29.15,3.59 J8.P$5 26.79,3.59 25.2,2 23.74,2 22.15,3.59 J8.P$3
EXT_5V  (via drill 0.35, 1)
  Top 0.254: v27.3,30.51 25.87,30.51 R25.2
  Top 0.406: X2.3 47.24,16.07 47.56,16.39 49.85,16.39 52.73,13.51 54.34,13.51 58.5,9.35 58.5,6.75 59.23,6.02 60.27,6.02 60.57,6.32 v61.59,6.32
  Top 1.016: v76.04,22.62 78.29,22.62 F2.2 | v61.59,6.32 61.59,9.56 54.91,16.24 54.91,17.94 52.73,20.12 51.54,20.12 v47.24,24.42
  Bottom 0.254: 44.92,25.1 44.98,24.44 44.2,23.65 43.7,23.65 43.67,23.62 42.69,23.62 35.8,30.51 v27.3,30.51
  Bottom 1.016: J10.P$9 94.66,36.34 86.02,36.35 86.02,31.27 84.77,30.03 84.77,26.22 81.34,22.62 v76.04,22.62 74.97,22.62 73.73,23.86 71.37,23.86 68.26,26.98 68.26,29.19 66.04,31.41 66.04,36.04 56.49,36.04 55.22,34.77 48.58,34.77 46.35,32.29 46.33,31.29 46.33,27.33 44.92,25.91 44.92,25.1 45.6,24.42 v47.24,24.42 | v61.59,6.32 61.59,3.93 J9.P$4
EXT_D6  (via drill 0.35)
  Top 0.203: U4.15 73.73,30.07 v74.45,30.8
  Bottom 0.254: v74.45,30.8 77.81,30.8 86.03,39.01 86.03,40.46 86.36,40.8 89.58,40.8 J10.P$7
EXT_INT  (via drill 0.35)
  Top 0.254: v59.85,17 59.04,17.81 IC1.30
  Top 0.305: J9.P$3 59.14,3.59 60.65,5.1 62.47,5.1 63.08,5.71 63.08,9.85 v59.82,13.11
  Bottom 0.305: v59.85,17 59.85,13.15 v59.82,13.11
GND  (via drill 0.35, 0.4, 0.5, 0.5 pad 0.2, 0.9, 0.9 pad 0.2, 1)  (2 unrouted)
  Top 0.152: 42.02,34.21 U2.6
  Top 0.2: 83.81,27.94 83.48,27.94 | C4.2 U$4.1 89.1,32.1 U$4.PAD | U$4.4 90.6,32.1 | U$4.5 90.6,32.1 | U$4.PAD 90.6,32.1 | C3.2 87.95,32.1 U$4.PAD | 88.09,29.47 89.09,29.47
  Top 0.203: U4.26 71.99,27.7 U4.3 | 72.79,27.7 U4.10 75.17,27.7 75.41,27.94 76.52,27.94 76.84,27.62 77.71,27.62 78.03,27.94 83.48,27.94 | U4.17 72.79,28.5 | 84.45,27.94 85.59,27.94 86.13,27.39 86.82,27.39 87.87,27.39 88.33,27.86 88.33,28.93 C4.2 | 84.45,27.94 83.81,27.94 | U$18.2 83.12,31.34 83.55,30.91 83.55,30.41 84.45,29.5 84.45,27.94
  Top 0.254: 30.5,26.81 U$7.4 30.5,24.85 29.62,23.97 26.81,23.97 26.45,23.61 26.45,20.61 23.37,17.53 23.37,15.92 22.3,14.86 22.3,11.1 18.22,7.02 14,7.02 13.97,6.98 J8.P$1 | U$7.1 29,26.27 30.83,28.1 | U$7.30 29.5,28.1 | 58.04,27.2 IC1.TH | 58.04,27.2 IC1.28 | IC1.39 IC1.TH | 58.04,27.2 58.02,27.22 IC1.18 54.22,27.22 53.81,27.63 C21.2 | IC1.6 IC1.TH | U2.6 42.91,34.21 43.81,33.31 | 43.81,33.31 U2.21 | 43.91,33.41 U2.3 | 43.91,33.41 43.81,33.31 | U2.13 43.91,33.41 | C23.2 35.27,34.83 | 26.74,39.08 28.32,37.5 | 32.53,36.1 31.13,37.5 28.32,37.5 | C14.2 41.91,30.22 v41.91,31.4 | 32.53,36.1 32.53,35.75 32.69,35.59 32.69,34.83 31.67,33.81 30.86,33.81 30.73,33.94 U$10.2 | R1.1 96.69,35.09 | U6.THERMAL@5 | U6.THERMAL@14 U6.THERMAL@13 | U6.THERMAL@13 U6.THERMAL@12 U6.THERMAL@11 | U6.THERMAL@13 100.97,30.39 U6.THERMAL@5 | 28.32,37.5 28.19,37.12 C22.2 27.39,35.04 27.39,32.34 | U$7.6 31.5,28.03 31.57,28.1 | 97.92,35.09 98.79,34.23 98.79,32.83 98.79,32.45 99.08,32.15 U6.7 100.83,32.15 100.97,32.29 | C2.2 103.89,32.73 v103.89,33.31 | v102.36,33.69 100.97,32.29 | 100.97,32.29 U6.THERMAL@6 | U$17.2 86.82,25.37 86.82,27.39 | 108.2,32.68 108.2,39.53 J10.P$10 101.35,41.31 | C17.2 10.79,37.2 Q11.2 | 35.27,34.83 35.25,34.83 35.25,36.04 35.2,36.1 32.53,36.1 | R47.2 33.91,34.12 35.27,34.12 35.27,34.83 | 38.96,4.77 39.65,4.08 39.65,3.1 38.96,2.41 37.98,2.41 36.8,3.59 | U6.THERMAL@8 U6.THERMAL@7
  Top 0.305: 30.5,26.81 30.48,26.83 U$7.EXP | 31.87,27.98 U$7.EXP | U$7.33 U$7.32 28.35,30.5 | U$7.30 U$7.31 28.35,30.5 | 29.5,28.1 30.83,28.1 31.57,28.1 U$7.EXP | 2.22,10.05 U$2.MT2 | 75.88,10.06 RTC1.5 | U4.29 72.39,27.7 71.99,27.7 U4.29 | 72.79,27.7 U4.29 | 72.79,28.5 U4.29 | 75.88,10.06 v75.88,11.43 | U$7.34 U$7.33 | 102.34,35.69 98.01,35.69 | C11.2 97.92,35.09 98.01,35.69 | IC1.6 58.04,32.16 59.57,33.69 62.01,33.69 62.01,34.36 61.84,34.54 61.84,34.71 60.98,35.57 60.29,35.57 | C25.1 51.05,36.17 v52.05,37.17 52.37,37.17 52.41,37.13 54.85,37.13 56.15,35.83 60.03,35.83 60.29,35.57 | CX2.1 CX3.1 8.17,29.15 | 8.17,29.15 7.33,29.15 6.25,30.23 MICRO_USB.5 | 8.17,25.6 8.17,29.15 | U2.6 v41.91,35.08 | 28.35,30.5 28.35,31.38 27.39,32.34 | 84.41,18.77 U$6.16 | 8.17,25.6 5.83,23.25 U$2.MT1 | 98.01,35.69 96.65,35.69 v96.65,36.45 | C5.1 60.29,35.57 | R29.1 26.71,25.85 27.56,26.7 27.56,29.1 U$7.33 | 8.17,25.6 9.8,23.97 10.92,23.97 11.74,23.97 11.88,24.1 U$19.2 | 75.88,10.06 75.25,9.43 71.25,9.43 | J9.P$6 71.25,6.53 71.25,9.43 | 71.25,9.43 C8.2 | U$5.2 U$5.1 | C24.2 R28.1 37.97,5.75 38.95,4.77 38.96,4.77 | J8.P$7 36.8,3.59
  Top 0.406: U3.8 102.64,5.24 arc90 U3.8 | 95.15,7.27 v91.76,7.27 | 95.15,7.27 96.52,7.27 96.52,6.51 97.79,5.24 102.28,5.24 | 2.22,10.05 2.22,19.26 3.25,20.15 | 3.25,20.15 U$2.6 | C10.2 v112.63,1.9 | v111.98,7.05 107.24,7.05 105.41,5.24 102.28,5.24 | 102.28,5.24 U3.8 | U3.1 111.98,18.99 v111.98,19.21 | 95.15,8.71 U$6.5 U$6.4 | 95.15,8.71 95.15,7.27 | U$6.16 84.86,19.22 87.47,19.22 | U$6.15 87.64,20.78 87.98,20.44 87.98,19.73 87.48,19.22 87.47,19.22 | U$6.20 86.2,11.6 87.63,13.03 87.63,14.13 87.47,14.29 87.47,16.67 | U$6.1 87.64,10.63 88.6,11.59 v90.17,11.59 98.03,11.59 U$6.6 | 87.47,16.67 87.47,19.22 | v93.98,16.82 95.25,18.09 95.25,19.24 | 95.25,19.24 95.25,21.75 U$6.11 95.24,25.42 v96.65,26.83 | U$6.10 98,19.24 95.25,19.24 | 95.15,11.5 95.15,8.71 | 87.47,16.67 v88.9,16.67 | 8.89,41.69 U$9.1 8.91,43.65 26.04,43.65 27.3,42.39 J2.1 27.3,39.65 26.74,39.08 C18.2 25.92,38.26 ISP2.6 | 8.89,41.69 U$9.2 | U$5.2 5.97,5.99 5.97,6 5.97,7.02 2.93,10.05 U$2.MT2 | X2.1 48.11,15.65 49.73,15.65 52.48,12.9 54.06,12.9 57.78,9.18 57.78,5.8 56.05,4.06 arc45 56.01,3.97 56.01,3.26 arc45 v56.13,2.95 | 3.25,20.15 3.16,20.24 U$2.MT1 1.27,23.25 1.27,34.96 2.6,36.29 C13.2 | C17.2 R22.1 8.03,36.29 C13.2 | 8.89,41.69 8.77,41.56 v7.49,41.56 | v6.48,37.5 C13.2 | J8.P$1 15.65,3.59 16.93,2.31 29.34,2.31 | J8.P$7 33.35,3.59 32.2,2.31 29.34,2.31 | JP1.1 29.34,9.28 29.34,2.31
  Top 0.61: C27.2 C19.2 96.7,28.52 C26.2 96.65,27.59 v96.65,26.83
  Top 1.016: 101.28,39.6 J10.P$10 | J4.1 109.36,25.61 108.68,26.16 108.68,32.2 108.2,32.68 104.09,32.68 C2.2 | v112.63,1.9 120.68,1.9 arc90 X1.GND@2 | U3.10 arc90 117.21,7.05 v111.98,7.05 | 89.09,29.17 89.09,29.47 C4.2 | v33.34,42.7 99.95,42.7 101.35,41.31
  Top 1.27: J6.GND J6.P$4 | X1.GND@1 arc-90 120.68,6.99 U3.10
  Bottom 0.254: v41.91,31.4 v41.91,35.08 42.38,35.08 45.23,37.93 arc-1 49.88,37.93 50.63,37.18 v52.06,37.18 | v103.89,33.31 103.51,33.69 v102.36,33.69
  Bottom 0.305: v75.88,11.43 77.79,11.43 BT1.GND | 51.82,36.94 v52.06,37.18
  Bottom 0.406: v91.76,7.27 89.22,7.27 89.22,4.29 J1.1 86.36,1.43 69.85,1.43 68.3,2.98 | 68.3,2.98 J9.P$6 | J10.P$1 68.38,38.22 55.3,38.22 54.26,37.18 v52.06,37.18 v52.05,37.17 | v93.98,16.82 92.86,16.82 91.54,15.49 | v90.17,11.59 90.17,14.13 91.54,15.49 | v88.9,16.67 90.36,16.67 91.54,15.49 | v56.13,2.95 56.59,2.95 58.48,1.06 66.38,1.06 68.3,2.98 | v7.49,41.56 6.48,40.54 v6.48,37.5
  Bottom 0.61: 111.98,22.8 111.76,23.02 | v96.65,26.83 v96.65,36.45
  Bottom 0.813: v33.34,42.7 66.64,42.7 J10.P$1
  Bottom 1.016: v33.34,42.7 27.94,42.7 J2.1 | 111.98,22.8 v111.98,19.21 v111.98,7.05 111.98,2.56 v112.63,1.9
  Bottom 1.27: 94.44,22.82 106.02,22.82 106.22,23.02 120.33,23.02 120.3,37.09 117.71,39.66 108.62,39.66 108.5,39.53 J10.P$10
  other vias: 89.85,32.1
  pour Top (isolate 0.152, rank 2, no thermals): 99.19,33.31 98.93,33.56 95.76,33.56 95.76,35.72 109.09,35.59 109.09,31.78 99.19,31.78
  pour Top (isolate 0.152, no thermals): 86.74,29.24 98.55,29.24 98.55,24.67 97.54,23.4 86.74,23.4
  pour Top (no thermals): 88.52,32.67 90.81,32.67 90.81,30.64 90.04,30.64 89.92,30.51 89.92,28.61 89.28,27.97 87,27.97 86.49,28.48 86.49,33.43 88.39,33.43 88.39,32.8
  pour Bottom (isolate 0.152, no thermals): 122.94,22 84.2,22 83.44,22.89 83.44,34.96 86.23,37.75 90.93,37.75 96.65,43.47 117.73,43.47 123.57,37.62 123.57,22.89
  pour Top (isolate 0.152, rank 2): 99.82,36.73 99.82,41.31 98.04,43.08 119.38,43.08 123.44,38.89 123.44,21.24 112.78,21.24 99.95,34.19
  pour Top (isolate 0.152): 12.32,0.92 12.32,6.25 15.87,9.81 20.32,9.81 21.97,11.46 21.97,15.02 23.37,16.41 23.37,18.07 26.16,20.86 26.16,23.91 24.64,25.43 24.64,31.4 25.65,32.42 26.8,32.42 26.8,34.58 27.56,35.34 27.56,35.97 27.94,36.35 27.94,39.53 30.23,41.81 48.51,41.81 52.07,38.26 52.07,37.75 50.42,36.1 41.53,36.1 40.39,34.96 40.39,26.57 37.46,23.65 36.2,23.65 34.42,21.88 34.42,17.3 46.1,5.75 54.42,5.75 56.01,4.1 59.82,0.16 12.95,0.16
GPIO_EXT1  (via drill 0.35)
  Top 0.203: U4.19 71.99,32.46 v72.39,32.86
  Top 0.254: v69.53,34.61 64.61,39.53 J5.P$1
  Bottom 0.305: v72.39,32.86 71.28,32.86 v69.53,34.61
GPIO_EXT2  (via drill 0.35)
  Top 0.203: U4.20 71.59,31.44 v71.12,31.91
  Top 0.305: v68.26,34.77 65.88,34.77 61.12,39.53 J5.P$2
  Bottom 0.305: v71.12,31.91 70.8,31.91 68.26,34.45 v68.26,34.77
GPIO_EXT3  (via drill 0.35)
  Top 0.203: U4.21 71.19,30.25 v70.48,30.96
  Top 0.305: v67.63,33.81 66.04,33.81 61.56,38.29 57.74,38.29 J5.P$3
  Bottom 0.305: v70.48,30.96 v67.63,33.81
GPIO_EXT4  (via drill 0.35)
  Top 0.203: U4.22 69.69,29.3 v69.69,30.16
  Top 0.305: v67.43,32.66 66.4,32.66 61.4,37.66 56.48,37.66 54.61,39.53 J5.P$4
  Bottom 0.305: v69.69,30.16 69.61,30.48 v67.43,32.66
LED1
  Top 0.2: 77.43,25.74 81.55,25.74 R24.1
  Top 0.203: U4.6 73.19,25.5 73.34,25.34 77.03,25.34 77.43,25.74
LED2
  Top 0.2: 77.16,26.19 79.97,26.19 R14.1
  Top 0.203: U4.7 73.59,26.1 73.82,25.88 76.84,25.88 77.16,26.19
LED3
  Top 0.2: 77.22,27.07 78.81,27.07 arc90 R23.1
  Top 0.203: U4.8 74.7,26.9 75.25,26.35 76.5,26.35 77.22,27.07
LOG_INT  (via drill 0.35)
  Top 0.254: v11.56,3.59 11.21,3.25 R13.1 8.92,3.25 8.89,3.22 | v62.36,24.78 62.11,25.03 62.06,25.03 61.88,25.22 IC1.34 | 8.89,3.22 U$5.4 | 8.89,3.22 U$5.3 | v52.58,22.09 52.64,22.03 54.3,22.03 56.01,20.33 v56.01,17.69
  Bottom 0.254: v11.56,3.59 11.56,5.53 22.37,16.34 22.37,16.56 22.63,16.82 51.71,16.82 52.96,18.19 55.5,18.19 v56.01,17.69 | v62.36,24.78 62.11,25.03 62.06,25.03 61.92,25.18 55.5,25.18 52.58,22.26 v52.58,22.09
MISO  (via drill 0.35, 0.5)
  Top 0.254: J10.P$2 73.35,37.22 67.91,31.78 66.11,31.78 65.85,32.04 v64.39,32.04 64.29,31.93 63.02,31.93 62.87,31.78 60.35,31.78 60.06,31.49 60.06,31.06 IC1.2 | v99.78,19.72 100.32,19.18 100.32,18.01 101.71,16.75 U3.2 | v21.05,12.13 21.05,13.72 21.23,13.9 21.23,15.2 22.37,16.34 22.37,17.93 23.01,18.57 23.01,20.31 v23.02,20.32 | X2.6 39.81,13.01 v39.81,12.58
  Top 0.305: U$2.7 14.18,21.25 15.03,20.4 22.94,20.4 v23.02,20.32 | U3.2 102.28,16.83 | J2.4 19.81,42.07 19.81,36.99 ISP2.1
  Bottom 0.254: v99.78,19.72 99.42,20.08 88.1,20.08 87.39,20.95 68.51,20.95 68.36,21.11 64.01,21.11 63.04,22.08 | 64.53,31.89 v64.39,32.04 64.58,31.85 64.58,27.89 64.84,27.63 64.84,24.06 65.64,23.25 65.64,22.52 65.21,22.08 63.04,22.08 | v23.02,20.32 23.02,20.42 23.77,21.18 32.58,21.18 34.05,22.65 38.96,22.65 39.47,22.15 43.29,22.15 44.45,20.99 52.63,20.99 53.72,22.08 63.04,22.08 | v39.81,12.58 38.42,11.36 22.1,11.36 21.34,12.13 v21.05,12.13
  Bottom 0.305: ISP2.1 19.43,35.72 20.6,36.89 21.57,36.89 22.45,36 22.45,35.23 23.02,34.67 v23.02,20.32
MOSI  (via drill 0.35, 0.5, 0.5 pad 0.2)
  Top 0.254: J10.P$3 76.53,39.53 68.19,31.19 64.08,31.19 63.79,31.47 63.21,31.47 62.79,31.06 62.79,31.01 | v99.74,15.48 100.23,14.99 U3.3 | IC1.1 62.76,31.04 62.79,31.01 | v63.98,22.85 63.98,21.68 62.11,19.82 62.11,18.7 v62.06,18.65 | v63.37,29.75 62.79,30.32 62.79,31.01 | X2.9 41.45,20.28 40.39,19.21 41.21,18.38 41.21,18.14 43.53,15.83 43.8,15.83 45.94,17.97 45.94,18.16 v46.44,18.65
  Top 0.305: v21.21,17.94 19.8,17.93 14.14,17.93 13.07,16.85 U$2.3 | 102.25,14.75 U3.3 | J2.3 22.23,39.4 ISP2.4
  Bottom 0.254: ISP2.4 20.45,38.26 19.18,36.99 17.91,36.99 17.27,36.35 17.27,21.24 20.32,17.94 v21.21,17.94 41.42,17.94 42.14,18.65 v46.44,18.65 v62.06,18.65 62.47,18.65 64.14,16.99 65.25,16.99 65.88,17.62 71.71,17.62 72.82,18.73 83.23,18.73 83.85,17.94 97.28,17.94 v99.74,15.48 | v63.98,22.85 63.98,27.35 63.61,27.72 63.61,29.51 v63.37,29.75
MUX_INT  (via drill 0.35, 0.5)
  Top 0.203: U4.9 75.88,27.3 v76.04,27.15
  Top 0.254: v79.34,23.81 73.98,23.81 72.47,22.3 v70.59,22.3 | v67.87,23.2 67.57,23.51 67.56,23.51 66.89,24.18 62.11,24.18 61.89,24.39 IC1.33
  Top 0.305: R12.1 70.59,23.97 v70.59,22.3
  Bottom 0.254: v70.59,22.3 68.77,22.3 v67.87,23.2
  Bottom 0.305: v79.34,23.81 v76.04,27.15
N$1
  Top 0.203: 83.61,32.92 Q5.1
  Top 0.254: U$18.4 83.9,31.05 83.9,31.38 83.58,31.7 83.58,32.28 83.87,32.56 Q5.1
N$2
  Top 0.2: U$4.7 89.6,34.04 L2.P$1
  pour Top (rank 3, no thermals): 89.41,32.8 89.41,33.43 89.28,33.56 88.77,33.56 88.52,33.81 88.52,35.46 88.65,35.59 89.41,35.59 89.54,35.46 89.54,34.07 89.79,33.81 89.79,32.8
N$3
  Top 0.254: Q7.1 15.54,26.56 14.81,25.83 13.27,25.83 U$19.4
N$4
  Top 0.203: 99.49,34.46 U6.6
  Top 0.254: 99.49,34.46 C1.1
N$5
  Top 0.305: IC1.7 57.53,31.05 57.53,32.04 56.84,32.73 U$1.OSC2 57.07,34.37 | 57.07,34.37 57.35,34.58 | C5.2 57.41,34.7 57.07,34.37
N$6
  Top 0.254: U6.8 99.48,31.67 99.03,31.67 98.26,32.44 98.26,33 C11.1
  Top 0.406: C11.1 R1.2 R2.1
N$7  (via drill 3.17)
  other vias: 121.68,42.78
N$8
  Top 0.305: U$1.OSC1 53.14,33.12 53.72,32.67 56.13,32.67 57.02,31.78 57.02,31.06 IC1.8 | 52.97,34.23 U$1.OSC1 | C25.2 52.29,33.34 U$1.OSC1
N$9
  Top 0.305: U$15.3 78.55,31.78 78.87,31.78 79.63,31.02 79.63,29.88 80.68,28.82 R14.2
N$10
  Top 0.305: U$15.4 78.87,29.86 R23.2
N$11  (via drill 3.17)
  other vias: 2.46,42.78
N$12  (via drill 3.17)
  other vias: 2.46,2.7
N$13
  Top 0.254: U$7.27 U$7.26
N$14
  Top 0.61: Q5.3 81.13,34.77 F1.1
N$15
  Top 0.2: R24.2 82.91,28.82 U$15.1
  Top 0.305: 82.91,28.82 R24.2
N$16
  Top 0.254: U$16.1 46.35,28.62 R5.1
N$18
  Top 0.406: F2.1 81.09,22.83
  Top 0.61: Q6.3 82.34,23.5 F2.1
N$20
  Top 0.254: R16.1 80.78,13.52 80.78,12.89 83.61,10.06 86.07,10.06 92.17,16.03 94.62,16.03 95.88,17.3 U$6.9
N$21
  Top 0.254: U$6.12 92.52,21.18 92.52,17.16 85.88,10.52 83.8,10.52 83.61,10.71 83.61,12.98 R17.1
N$22
  Top 0.254: U$10.1 31.68,36.3 30.94,37.04 30.15,37.04 29.21,36.1 29.21,34.36 C22.1
N$23
  Top 0.254: C23.1 33,34.39 33,32.76 | 33,32.76 U$7.23 | U$10.5 U$10.6 | U$10.6 31.73,32.34 | U$10.6 32.88,32.64 33,32.76
N$25
  Top 0.254: R10.2 47.2,32.71 U2.17
N$26
  Top 0.254: R4.1 48.51,29.5 47.84,28.82 47.84,27.45 48.03,27.26 48.15,27.26 U$16.3
N$28
  Top 1.27: X1.P arc-90 121.22,4.99 U3.9
N$30
  Top 0.254: Q6.1 85.27,23.85 85.65,24.23 87.01,24.23 U$17.4
N$31  (via drill 0.5)
  Top 0.406: RTC1.6 80.26,11.33 v83.82,7.78
  Bottom 0.254: v83.82,7.78 82.96,6.91 75.68,6.91 70.21,12.38 70.18,12.38
  Bottom 0.305: 70.18,12.38 BT1.POWER1
  Bottom 0.406: v83.82,7.78 85.41,9.37 BT1.POWER0
N$32
  Top 0.254: U6.1 102.44,27.17 U$8.P$1
  pour Top (rank 4, no thermals): 102.81,30.89 102.81,29.5 103.38,28.92 103.38,24.99 101.6,24.99 101.6,28.86 101.98,29.24 101.98,30.77 102.11,30.89
N$33
  Top 0.254: IC1.23 53.7,24.39 R6.1
N$34
  Top 0.254: Q11.3 12.46,38.45 | R21.2 12.93,38.51 Q11.3 | Q12.1 12.53,37.74 Q11.3
N$35
  Top 0.254: U2.1 44.91,36.05 45.34,36.48 46.99,36.48 47.66,35.81 R7.2
N$36  (via drill 0.35)
  Top 0.305: MICRO_USB.3 7.58,31.53 CX3.2 8.29,30.89 v9.65,30.89 | v11.68,32.92 12.57,33.81 D+.2
  Bottom 0.305: v9.65,30.89 v11.68,32.92
N$37
  Top 0.254: CX2.2 12.06,30.85 D-.2
  Top 0.305: MICRO_USB.2 9.85,32.18 CX2.2
N$38  (via drill 0.35)
  Top 0.254: U2.8 41.87,33.25 41.13,33.25 40.75,33.63 v40.46,33.63 | D+.1 17.15,33.81 17.63,33.33 24.11,33.33 v24.35,33.09
  Bottom 0.254: v40.46,33.63 36.44,33.63 35.33,34.74 26.62,34.74 24.98,33.09 v24.35,33.09
N$39  (via drill 0.35)
  Top 0.254: U2.11 42.91,31.74 42.44,32.21 U2.10 41.13,32.21 40.93,32.02 C14.1 | C14.1 40.89,29.5 | U2.20 45.65,34.47 v45.65,35.79 | C14.1 40.93,28.57 42.29,27.21 v44.27,27.21
  Bottom 0.254: v45.65,35.79 45.65,34.93 44.88,34.03 44.88,27.82 v44.27,27.21
N$41
  Top 0.254: U2.7 41.87,33.75 41.27,33.75 41.08,33.95 41.08,35.65 42.32,36.89 47.37,36.89 48.51,35.75 R4.2
N$43
  Top 0.254: U2.14 44.41,30.36 45.48,30.36 R5.2
N$46  (via drill 0.35)
  Top 0.254: U2.9 41.87,32.67 v40.46,32.67 | v23.75,32.48 16.32,32.48 15.62,31.78 D-.1
  Bottom 0.254: v40.46,32.67 36.75,32.67 35.14,34.28 26.82,34.28 25.02,32.48 v23.75,32.48
N$47
  Top 0.254: U6.10 99.49,27.75 U$8.P$2
  pour Top (rank 4, no thermals): 99.95,30.7 99.06,30.7 99.06,24.99 100.9,24.99 100.9,28.8 99.95,29.75
N$52
  Top 0.254: U$7.25 U$7.24
N$54
  Top 0.254: U$7.22 33.5,31.47 R47.1
  Top 0.305: R46.1 R47.1
N$56
  Top 0.203: U4.23 69.11,28.9 R11.1
RADIO_CS  (via drill 0.35, 0.5 pad 0.2)
  Top 0.254: 57.06,24.38 IC1.26 57.04,23.07 57.25,22.85 v57.78,22.85 | v62.97,22.85 63.82,23.7 66.72,23.7 67.16,23.25 67.16,22.91 67.85,22.22 v67.85,21.86
  Top 0.305: v105.41,12.86 105.41,11.83 104.54,10.95 102.31,10.95 U3.5
  Bottom 0.254: 68.28,21.86 v67.85,21.86 70.05,21.86 70.47,21.44 87.62,21.44 88.42,20.64 102.54,20.64 105.41,17.77 v105.41,12.86 | v62.97,22.85 v57.78,22.85
RADIO_INT  (via drill 0.35, 0.5)
  Top 0.254: IC1.42 62.08,29.22 v62.36,29.5 | v62.36,23.47 62.36,20.64 61.46,19.74 61.46,18.91 61.46,18.9 61.46,18.4 61.92,17.94 v64.26,17.94
  Top 0.305: U3.14 105.04,14.99 104,16.02 104.03,16.02 103.7,16.03 100.39,16.03 100.01,16.41 100.01,17.18 v99.63,17.56
  Bottom 0.254: v62.36,29.5 62.36,27.62 63.02,26.95 63.02,24.53 62.36,23.87 v62.36,23.47
  Bottom 0.305: 64.42,18.1 v64.26,17.94 64.45,18.13 71.47,18.13 72.58,19.24 83.47,19.24 84.14,18.45 93.65,18.45 93.85,18.46 93.86,18.45 98.74,18.45 v99.63,17.56
RADIO_RESET  (via drill 0.35)
  Top 0.254: U3.6 100.14,8.99 v99.06,7.91 | IC1.25 56.54,21.79 57.53,20.79 57.53,17.62 61.88,13.27 63.09,13.27 v63.37,12.99
  Bottom 0.254: v99.06,7.91 92.09,7.91 92.04,7.95 89.02,7.95 88.31,7.24 88.31,6.23 87.91,5.83 87.35,5.83 87.07,6.1 66.63,6.1 65.51,7.23 65.51,10.85 v63.37,12.99
REF_CTRL  (via drill 0.35)
  Top 0.254: U4.2 71.59,25.39 71.05,24.85 69.79,24.85 69.6,24.66 69.6,20.35 69.6,18.45 69.95,18.09 72.87,18.09 v73.03,17.94 73.03,18.54 R20.1 | v52.7,16.92 52.56,17.03 51.03,17.03 50.39,17.68 49.79,17.68 46.35,21.11 44.54,21.11 43.56,22.1 43.14,22.1 40.91,24.33 40.91,27.95 39.8,29.05 39.8,33.9 40.08,34.18 v40.08,36.35 | v30.48,36.35 29.78,35.66 U$10.3
  Bottom 0.254: v73.03,17.94 72.25,17.16 66.07,17.16 65.44,16.53 63.95,16.53 62.6,17.87 61.74,17.87 61.41,18.2 59.82,18.2 58.42,16.92 v52.7,16.92 | v30.48,36.35 v40.08,36.35
RST  (via drill 0.5)
  Top 0.254: v54.39,38.52 54.94,38.52 56.28,37.17 61.2,37.17 63.21,35.17 63.21,33.42 62.48,32.7 59.98,32.7 59.06,31.78 59.06,31.06 IC1.4 | U$9.4 7.44,39.49 8.24,38.68 8.37,38.68 9.41,38.68 9.58,38.84 9.58,40.02 10.33,40.76 R3.1 | C6.2 25.81,35.72 ISP2.5
  Top 0.305: v28.83,38.29 28.26,38.86 28.26,41.12 28.73,41.59 28.73,42.54 27.07,44.21 11.52,44.21 11.12,44.61 7.37,44.61 6.39,43.64 U$9.3 U$9.4
  Bottom 0.305: ISP2.5 26.19,38.29 v28.83,38.29 28.76,38.23 32.6,38.23 34.94,40.8 50.55,40.8 51.3,40.05 51.3,38.02 53.86,38.02 53.96,38.11 54.3,38.43 v54.39,38.52
RTC_INT  (via drill 0.35)
  Top 0.254: v60.67,16.22 60.63,16.39 60.63,17.96 59.54,19.06 IC1.31 | RTC1.3 74.17,11.33 74.42,11.59 74.42,14.15 74.06,14.51 v61.72,14.51
  Bottom 0.254: v60.67,16.22 60.67,15.56 v61.72,14.51
RX
  Top 0.2: IC1.9 56.49,31.09 56.49,31.62 55.95,32.16 52.02,32.16 51.45,31.59 50.7,31.59 R10.1
RX_EXT  (via drill 0.35)
  Top 0.254: IC1.11 53.1,31.04 52.68,30.62 51.28,30.62 50.52,29.86 50.52,23.49 51.27,22.74 54.51,22.74 56.77,20.48 56.77,17.3 63.51,10.56 63.51,10.28 63.51,10.06 63.51,4.9 62.97,4.36 62.97,2.91 63.97,1.91 75.48,1.91 76.48,2.91 76.48,4.08 75.79,4.77 74.81,4.77 73.63,3.59 J9.P$7 | X2.7 44.52,20.55 46.16,20.55 49.43,17.27 50.22,17.27 50.95,16.54 51.81,16.54 52.22,16.13 52.22,15.11 v53.04,14.29
  Bottom 0.254: J9.P$7 71.07,3.59 69,5.66 65,5.66 56.36,14.29 v53.04,14.29
SCK  (via drill 0.35, 0.5)
  Top 0.254: J10.P$4 78.6,37.78 75.5,37.78 68.15,30.43 63.84,30.43 v63.5,30.77 | v100.22,14.02 101.25,12.99 U3.4 | v62.89,19.49 64.94,21.54 v64.94,22.88 | v63.94,33.19 63.13,32.39 62.83,32.39 62.68,32.24 60.17,32.24 59.56,31.63 59.56,31.06 IC1.3 | X2.10 37.3,16.16 36.25,16.16 v33.72,18.69
  Top 0.305: U$2.5 6.31,18.89 v22.23,18.89
  Top 0.406: J2.5 17.32,41.76 17.32,35.21 18.04,34.5 19.05,34.5 20.27,35.72 ISP2.3
  Bottom 0.254: v62.89,19.49 63.37,19.49 64.06,18.81 65.41,18.81 65.56,18.65 71.23,18.65 72.39,19.81 83.63,19.81 84.14,19.18 96.52,19.18 96.77,18.93 99.5,18.93 100.54,17.88 100.54,14.34 v100.22,14.02 | v63.5,30.77 64.08,30.19 64.08,27.82 64.43,27.46 64.43,23.39 v64.94,22.88
  Bottom 0.305: v22.23,18.89 22.23,18.86 22.37,18.7 v33.72,18.69 41,18.68 41.81,19.49 42.17,19.49 v62.89,19.49 | 22.23,19.59 v22.23,18.89 | v63.5,30.77 63.5,32.75 v63.94,33.19 | v22.23,18.89 22.23,19.97 22.21,19.98 22.21,34.59 ISP2.3
SCL  (via drill 0.35, 0.5)
  Top 0.2: 69.07,28.1 67.96,26.99 67.96,26.4 67.59,26.03 67.59,25.09 67.61,25.07
  Top 0.203: 69.07,28.1 U4.25
  Top 0.254: 94.62,2.7 93.34,3.97 92.08,3.97 91.44,3.33 91.44,2.14 90.73,1.43 86.72,1.43 84.6,3.55 84.6,3.59 | 84.6,3.59 84.6,8.48 79.85,13.23 79.64,13.23 RTC1.8 78.37,14.51 78.37,15.82 78.6,16.05 79.94,16.05 80.13,16.25 80.13,17.02 | v53.47,26.7 54.7,26.7 IC1.19 | v62.36,26.7 62.64,26.99 63.12,26.99 | 63.12,26.99 63.24,26.99 63.24,25.99 64.15,25.07 67.61,25.07 67.76,24.92 68.36,24.92 69.04,24.24 69.04,18.13 69.54,17.63 72.22,17.63 72.72,17.14 77.05,17.14 77.63,17.71 79.94,17.71 80.13,17.52 80.13,17.02 | 63.12,26.99 | 84.6,3.59 J9.P$10 | X2.11 40.53,22.22 v40.53,23.76 | v24.93,22.84 21.69,22.84 19.84,24.69 Q9.2 18.5,25.07 18.2,24.77 R42.1 | R17.2 81.53,17.02 80.13,17.02
  Top 0.305: 94.62,2.7 J1.4
  Bottom 0.254: v53.47,26.7 v62.36,26.7 | v40.53,23.76 40.55,23.74 40.55,23.15
  Bottom 0.305: v24.93,22.84 25.69,23.65 39.58,23.65 40.09,23.15 40.55,23.15 42.62,23.15 42.68,23.09 50.35,23.09 53.22,25.95 53.22,26.2 53.47,26.45 v53.47,26.7
SCL_HV
  Top 0.254: U$7.2 29.5,25.21 29.21,24.92 23.62,24.92 R9.1
  Top 0.305: R9.1 22.52,24.87 Q9.3
SD_CS  (via drill 0.35, 0.5)
  Top 0.254: IC1.13 54.69,29.7 54.27,29.7 53.81,29.24 v53.72,29.24 | v51.43,17.81 50.82,17.81 50.55,18.08 50.15,18.08 46.61,21.62 44.73,21.62 43.24,23.11 42.69,23.11 42,23.8 42,25.28 42.69,25.97 43.67,25.97 44.13,25.51 v45.96,25.51
  Top 0.305: U$2.2 12.85,15.75 14.01,16.91 21.05,16.91 21.29,16.67 v21.59,16.67
  Bottom 0.254: v45.96,25.51 49.7,29.24 v53.72,29.24
  Bottom 0.305: v21.59,16.67 22.23,17.3 50.93,17.3 v51.43,17.81
SD_VCC  (via drill 0.5)
  Top 0.254: v7.31,17.95 U$2.4
  Top 0.305: Q7.3 13.97,24.46 v13.97,24.29
  Bottom 0.305: v13.97,24.29 13.65,24.29 v7.31,17.95
SD_VCC_CTRL  (via drill 0.35, 0.5)
  Top 0.2: U4.1 68.62,26.12 v68.17,25.67
  Top 0.254: U$19.1 11.24,24.69 11.24,25.24 11.43,25.43 14.97,25.43 14.98,25.43 15.62,25.43 16.68,24.38 16.68,23.42 19.05,21.05 23.32,21.05 23.95,20.42 v24.23,20.42
  Top 0.305: v70.87,19.45 v73.76,22.32
  Bottom 0.305: v73.76,22.32 73.41,22.32 72.71,23.02 70.82,23.02 v68.17,25.67 | 69.85,19.37 69.86,19.37 | 69.85,19.37 70.01,19.45 v70.87,19.45 | 69.85,19.37 64.24,19.37 63.13,20.48 39.04,20.48 38.24,19.68 30.59,19.68 30.28,19.37 25.04,19.37 24.23,20.18 v24.23,20.42
SDA  (via drill 0.35, 0.5)
  Top 0.203: U4.24 68.34,28.5 v67.22,27.37
  Top 0.254: RTC1.7 77.47,12.6 | 77.47,12.6 77.47,10.7 80.14,10.7 80.39,10.45 80.39,3.59 | 77.47,12.6 77.47,16.68 | J1.3 90.65,0.63 85.25,0.63 83.69,2.19 80.65,2.19 80.39,2.44 80.39,3.59 | R16.2 79.17,16.68 77.47,16.68 | v62.36,25.74 62.61,25.49 62.65,25.49 62.84,25.3 63.12,25.3 63.81,24.61 64.34,24.61 | 77.47,16.68 72.53,16.68 72.03,17.18 68.96,17.18 68.58,17.56 68.58,23.5 67.88,24.19 v67.88,24.29 67.82,24.29 67.49,24.61 64.34,24.61 | 64.34,24.61 | v25.72,22.03 25.01,21.33 25.01,19.92 22.83,17.74 22.83,16.15 21.76,15.09 21.76,11.83 21.05,11.12 v21.05,10.86 | v40.98,11.42 42.59,13.03 X2.4 | v25.72,22.03 25.69,22 | v25.72,22.03 25.69,22.07 18.67,22.07 17.06,23.68 17.06,26.97 17.97,27.88 R43.1 19.51,27.88 Q8.2 | J9.P$9 80.39,3.59
  Top 0.305: IC1.20 54.13,26.22 v53.85,25.94
  Bottom 0.254: v21.05,10.86 21.1,10.91 40.47,10.91 v40.98,11.42
  Bottom 0.305: v25.72,22.03 26.83,23.15 39.29,23.15 39.8,22.64 42.49,22.64 42.49,22.63 50.54,22.63 v53.85,25.94 62.16,25.94 v62.36,25.74 | v67.88,24.29 67.22,24.96 v67.22,27.37
SDA_HV
  Top 0.254: U$7.3 30,24.92 29.53,24.45 24.58,24.45 24.22,24.09 22.22,24.09 21.06,25.25 21.06,26.18 21.72,26.84 Q8.3 22.77,28.89 R8.1
SPI_EXT_CS1  (via drill 0.5)
  Top 0.203: 76.2,36.99 75.88,36.99 73.56,34.67 73.56,31.18 73.19,30.8 U4.16
  Top 0.305: 76.2,36.99 v76.2,36.97
  Bottom 0.254: J2.6 16.06,43.52 32.49,43.52 32.85,43.88 73.53,43.88 75.65,41.76 75.65,38.96 76.2,38.53 v76.2,36.97
SPI_EXT_CS2  (via drill 0.35)
  Top 0.203: U4.14 74.86,29.3 v75.56,30
  Bottom 0.305: v75.56,30 77.83,30 J10.P$6
THERM_GND  (via drill 0.35)
  Top 0.305: R15.1 28.7,18.95 | 28.7,18.95 R19.1 | C9.2 28.7,16.92 | 28.7,16.92 C15.2 | R18.1 28.7,14.89 | 28.7,14.89 R26.1 | C12.2 28.7,12.86 | 28.7,12.86 C16.2 | 28.7,18.95 28.7,16.92 | 28.7,16.92 28.7,14.89 | 28.7,14.89 v28.7,13.87 28.7,12.86 | v32.38,14.51 32.38,12.9 R27.1 C20.2
  Top 0.406: JP1.2 28.7,12.86
  Bottom 0.305: v32.38,14.51 29.34,14.51 v28.7,13.87
TX  (via drill 0.35)
  Top 0.2: R7.1 50.19,33.88 50.19,32.77 50.44,32.52 50.98,32.52 v51.21,32.29 | v52.13,31.34 52.74,31.34 53.13,31.72 55.78,31.72 56.02,31.49 56.02,31.06
  Top 0.254: 56.02,31.06 IC1.10
  Bottom 0.254: v51.21,32.29 52.13,31.36 v52.13,31.34
TX_EXT  (via drill 0.35)
  Top 0.254: v38.18,14.21 | v38.18,14.21 X2.8 | IC1.12 51.45,30.22 50.93,29.69 50.93,23.65 51.43,23.15 54.64,23.15 57.15,20.64 57.15,17.46 63.89,10.72 63.89,4.71 63.37,4.19 63.37,3.08 64.14,2.32 74.04,2.32 J9.P$8
  Bottom 0.254: J9.P$8 74.04,2.32 71.31,2.32 68.43,5.2 64.56,5.2 61.28,8.48 47.18,8.48 41.45,14.21 v38.18,14.21
VUSB  (via drill 0.35)
  Top 0.254: 10.82,34 C17.1 11.34,33.98 11.68,34.31 11.68,34.83 | Q11.1 11.68,38.22 11.68,36.48 | 11.68,36.48 11.68,34.83 | Q12.3 11.68,36.48 | v23.75,31.62 16.03,31.62 15.37,30.95 15.31,30.95 14.08,30.95 13.77,31.26 13.77,34.48 13.42,34.83 11.68,34.83 | v42.13,28.28 42.51,28.65 43.3,28.65 43.52,28.88 43.52,30.05 43.41,30.16 U2.12
  Top 0.305: C13.1 6.48,33.18 6.13,32.83 MICRO_USB.1
  Top 0.406: C13.1 6.88,33.98 R22.2 C17.1
  Bottom 0.254: v23.75,31.62 29.67,31.62 30.23,32.17 35.03,32.17 41.35,25.85 41.96,25.85 42.38,26.27 42.38,26.88 42.13,27.13 v42.13,28.28

## Text on the board
bPlace: TLog v1.0.1 / ---------------------- / Open-source scientific / data logger / ---------------------- / Made in Minnesota | TM | Open-source for the outdoors | Developed in part at the / University of Minnesota in / parntnership with / Northern Widget LLC | TM
tDocu: SPI | D0 | D1 | D2 | D3 | GND | DI | DO | SCK | 3V3 | D4 | D5 | BAT | 5V | GND | VIN | A11 | A10 | A9 | A8 | A7 | A6 | RST | ISP | INT1 | SCL | A0 | 3V3 | A2 | A3 | A4 | 3V3 | A5 | 5V | 3V3 | GND | RX | GND | A1 | 3V3 | GND | 3V3 | TX | SDA | LOG | I2C